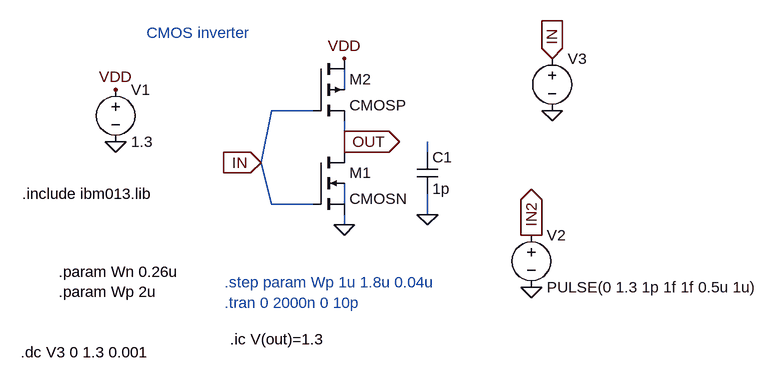
[diagram p0: schematic cmos inverter.asc]
cmos inverter.asc, the LTspice schematic file:
Version 4
SHEET 1 952 680
WIRE 240 96 240 64
WIRE 192 128 128 128
WIRE 240 176 240 144
WIRE 240 192 240 176
WIRE 368 192 368 176
WIRE 112 208 128 128
WIRE 128 272 112 208
WIRE 192 272 128 272
WIRE 240 272 240 240
WIRE 368 288 368 256
WIRE 240 304 240 288
FLAG 240 304 0
FLAG -112 176 0
FLAG -112 96 VDD
FLAG 240 48 VDD
FLAG 112 208 IN
IOPIN 112 208 In
FLAG 240 176 OUT
IOPIN 240 176 Out
FLAG 528 400 0
FLAG 528 320 IN2
IOPIN 528 320 Out
FLAG 368 288 0
FLAG 560 128 0
FLAG 560 48 IN
IOPIN 560 48 In
SYMBOL cmosn 192 192 R0
SYMATTR InstName M1
SYMATTR Value2 l=0.13u w={Wn} ad={Wn*0.26u} as={Wn*0.26u} pd={0.52u+2*Wn} ps={0.52u+2*Wn}
SYMBOL cmosp 192 48 R0
SYMATTR InstName M2
SYMATTR Value2 l=0.13u w={Wp} ad={Wp*0.26u} as={Wp*0.26u} pd={0.52u+2*Wp} ps={0.52u+2*Wp}
SYMBOL voltage -112 80 R0
WINDOW 123 0 0 Left 0
WINDOW 39 0 0 Left 0
SYMATTR InstName V1
SYMATTR Value 1.3
SYMBOL voltage 528 304 R0
WINDOW 123 0 0 Left 0
WINDOW 39 0 0 Left 0
SYMATTR InstName V2
SYMATTR Value PULSE(0 1.3 1p 1f 1f 0.5u 1u)
SYMBOL cap 352 192 R0
SYMATTR InstName C1
SYMATTR Value 1p
SYMBOL voltage 560 32 R0
WINDOW 123 0 0 Left 0
WINDOW 39 0 0 Left 0
SYMATTR InstName V3
SYMATTR Value ""
TEXT -64 8 Left 2 ;CMOS inverter
TEXT -256 256 Left 2 !.include ibm013.lib
TEXT -200 376 Left 2 !.param Wn 0.26u\n.param Wp 2u
TEXT 56 392 Left 2 ;.step param Wp 1u 1.8u 0.04u
TEXT 56 424 Left 2 ;.tran 0 2000n 0 10p
TEXT 64 480 Left 2 !.ic V(out)=1.3
TEXT -258 500 Left 2 !.dc V3 0 1.3 0.001

The netlist it stands for:
* cmos inverter.asc
M1 OUT IN 0 N003 CMOSN l=0.13u w={Wn} ad={Wn*0.26u} as={Wn*0.26u} pd={0.52u+2*Wn} ps={0.52u+2*Wn}
M2 VDD IN OUT N001 CMOSP l=0.13u w={Wp} ad={Wp*0.26u} as={Wp*0.26u} pd={0.52u+2*Wp} ps={0.52u+2*Wp}
V1 VDD 0 1.3
V2 IN2 0 PULSE(0 1.3 1p 1f 1f 0.5u 1u)
C1 N002 0 1p
V3 IN 0
.model NMOS NMOS
.model PMOS PMOS
.lib standard.mos
* CMOS inverter
.include ibm013.lib
.param Wn 0.26u
.param Wp 2u
* .step param Wp 1u 1.8u 0.04u
* .tran 0 2000n 0 10p
.ic V(out)=1.3
.dc V3 0 1.3 0.001
.backanno
.end